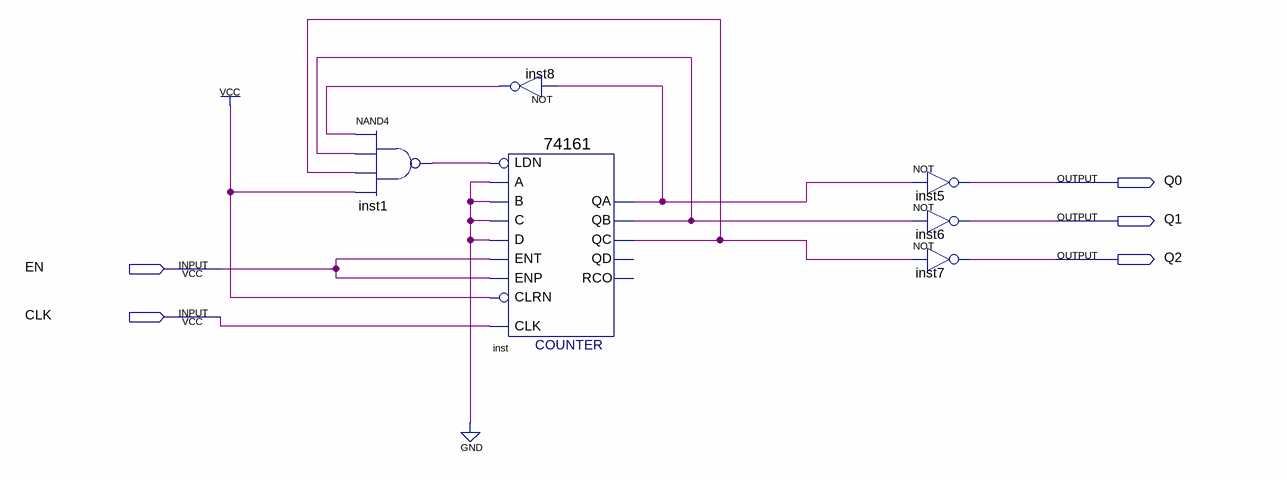
[diagram p0: schematic sheet]
// Quartus schematic M7.bdf as structural Verilog: 6 symbols, 5 pins
module M7 (
  input  EN,
  input  CLK,
  output Q0,
  output Q1,
  output Q2
);

  wire inst1_out, inst8_out, inst_qa, inst_qb, inst_qc;

  nand inst1 (inst1_out, inst8_out, inst_qb, inst_qc, 1'b1);
  \74161  inst (
    .CLRN(1'b1), .CLK(CLK), .ENP(EN), .LDN(inst1_out), .A(1'b0), .D(1'b0), .ENT(EN), .B(1'b0), .C(1'b0),
    .QC(inst_qc), .QB(inst_qb), .QA(inst_qa));  // open: QD, RCO
  not inst8 (inst8_out, inst_qa);
  not inst5 (Q0, inst_qa);
  not inst6 (Q1, inst_qb);
  not inst7 (Q2, inst_qc);
endmodule
